# Altium schematic sheet eVV_Cover Page.SchDoc: eVV_Cover Page
size A4; DrawnBy: Ivica Matovic; Revision: 1.1; SheetNumber: 1; SheetTotal: 8
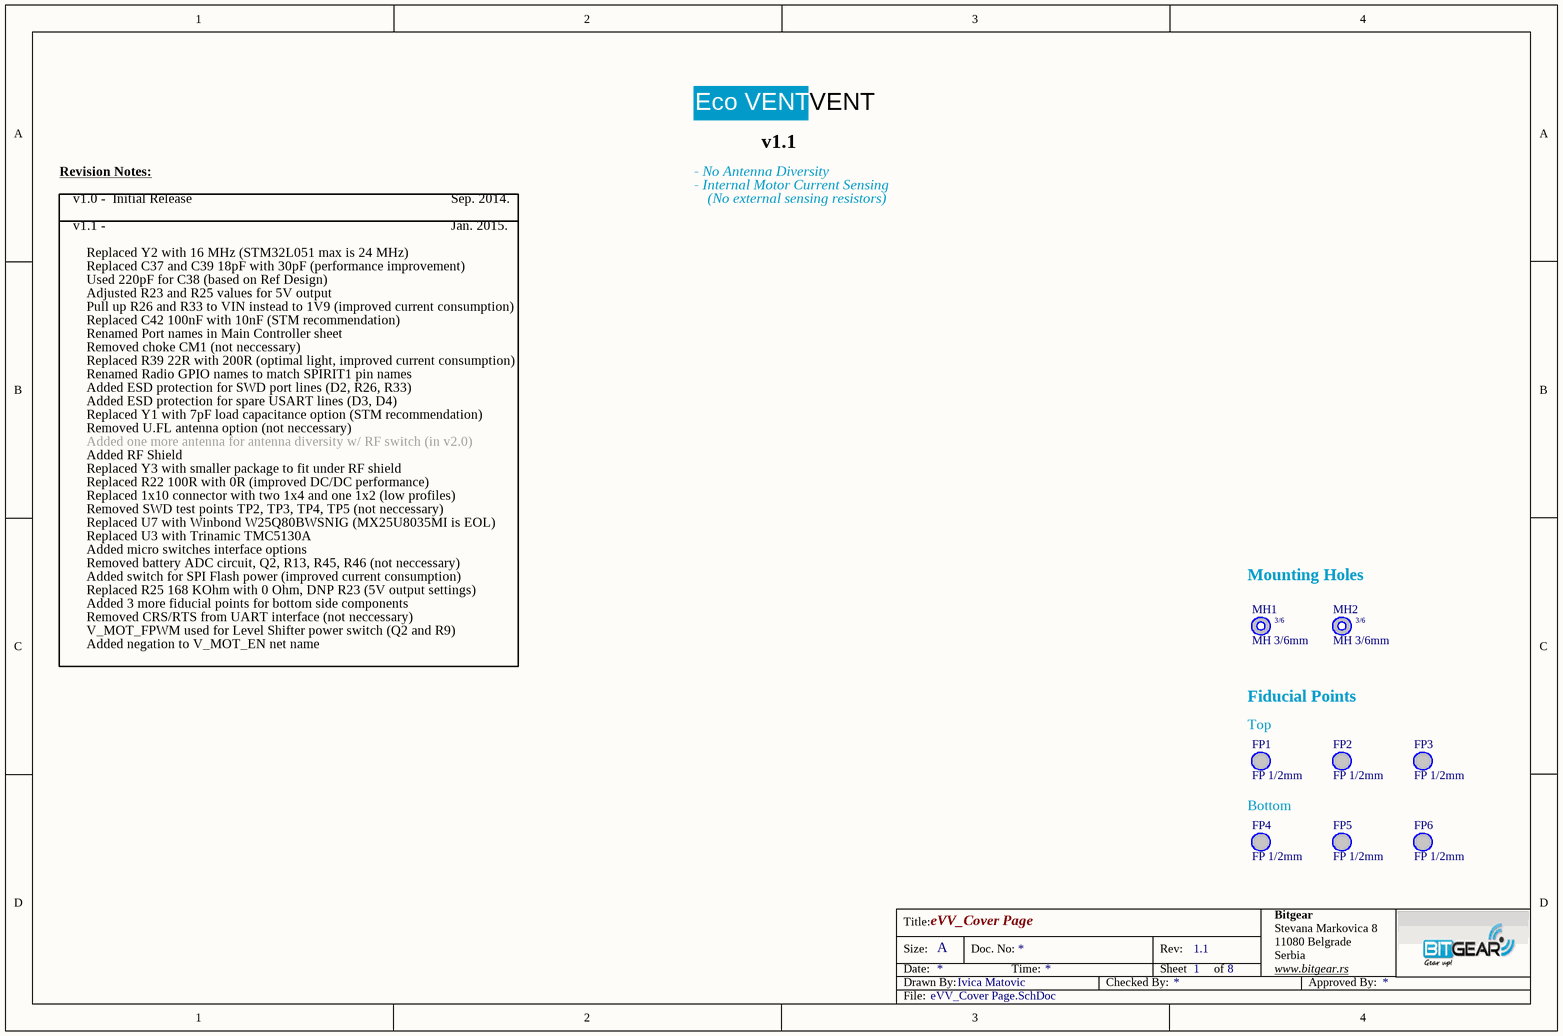
[diagram p0: eVV_Cover Page.SchDoc]

## Parts
FP1  FP 1/2mm  [FIDUCIAL_POINT_1MM]  (no BOM)
FP2  FP 1/2mm  [FIDUCIAL_POINT_1MM]  (no BOM)
FP3  FP 1/2mm  [FIDUCIAL_POINT_1MM]  (no BOM)
FP4  FP 1/2mm  [FIDUCIAL_POINT_1MM]  (no BOM)
FP5  FP 1/2mm  [FIDUCIAL_POINT_1MM]  (no BOM)
FP6  FP 1/2mm  [FIDUCIAL_POINT_1MM]  (no BOM)
MH1  MH 3/6mm  [MHOLE_TH_3-6MM]  (no BOM)
MH2  MH 3/6mm  [MHOLE_TH_3-6MM]  (no BOM)

## Notes on the sheet
- Eco VENT
- VENT
- Revision Notes:
- - No Antenna Diversity
- v1.1
- v1.0 -  Initial Release
- v1.1 -
- Sep. 2014.
- Jan. 2015.
- - Internal Motor Current Sensing
- (No external sensing resistors)
- Replaced Y2 with 16 MHz (STM32L051 max is 24 MHz)
- Replaced C37 and C39 18pF with 30pF (performance improvement)
- Used 220pF for C38 (based on Ref Design)
- Adjusted R23 and R25 values for 5V output
- Pull up R26 and R33 to VIN instead to 1V9 (improved current consumption)
- Replaced C42 100nF with 10nF (STM recommendation)
- Renamed Port names in Main Controller sheet
- Renamed Radio GPIO names to match SPIRIT1 pin names
- Removed choke CM1 (not neccessary)
- Replaced R39 22R with 200R (optimal light, improved current consumption)
- Added ESD protection for SWD port lines (D2, R26, R33)
- Replaced Y1 with 7pF load capacitance option (STM recommendation)
- Added ESD protection for spare USART lines (D3, D4)
- Added one more antenna for antenna diversity w/ RF switch (in v2.0)
- Removed U.FL antenna option (not neccessary)
- Added RF Shield
- Replaced Y3 with smaller package to fit under RF shield
- Replaced R22 100R with 0R (improved DC/DC performance)
- Replaced 1x10 connector with two 1x4 and one 1x2 (low profiles)
- Removed SWD test points TP2, TP3, TP4, TP5 (not neccessary)
- Replaced U7 with Winbond W25Q80BWSNIG (MX25U8035MI is EOL)
- Removed battery ADC circuit, Q2, R13, R45, R46 (not neccessary)
- Added switch for SPI Flash power (improved current consumption)
- Replaced U3 with Trinamic TMC5130A
- Added micro switches interface options
- Mounting Holes
- Replaced R25 168 KOhm with 0 Ohm, DNP R23 (5V output settings)
- Added 3 more fiducial points for bottom side components
- Removed CRS/RTS from UART interface (not neccessary)
- V_MOT_FPWM used for Level Shifter power switch (Q2 and R9)
- Added negation to V_MOT_EN net name
- Fiducial Points
- (near FP1) Top
- Bottom
- Title:
- Bitgear
- Size:
- Date:
- Drawn By:
- A
- Doc. No:
- Time:
- Checked By:
- Sheet
- Rev:
- of
- Stevana Markovica 8
- 11080 Belgrade
- Serbia
- www.bitgear.rs
- Approved By:
- File:
- (in symbol MH 3/6mm) 3/6

## Library data of the parts
FP1-FP6 = FP 1/2mm: Fiducial point; D Price: 0; D P/N: FIDUCIALP; M P/N: FIDUCIALP; Mounting: SM
MH1 MH2 = MH 3/6mm: Mounting Hole Not-plated; D P/N: MHOLE; D Price: 0; M P/N: MHOLE; Mounting: SM